# Altium schematic sheet OSPLC2_2_IO3.SchDoc
size 294 x 198 mm
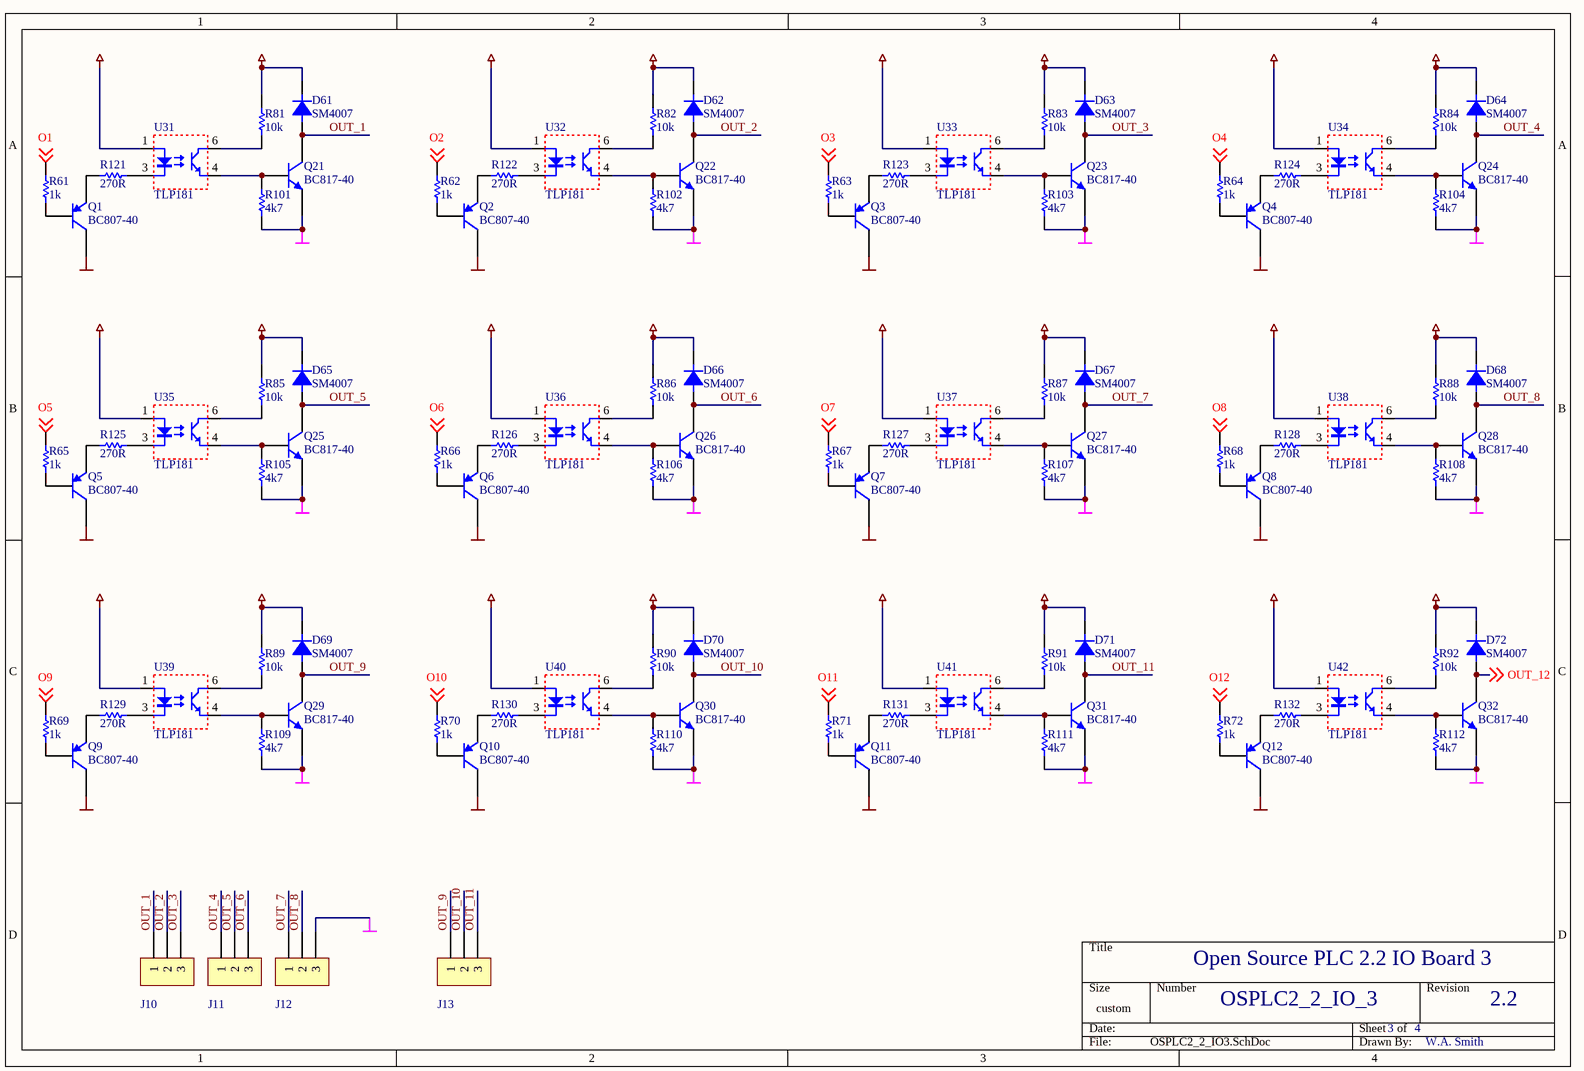
[diagram p0: OSPLC2_2_IO3.SchDoc]

## Parts
D61  SM4007  [MELF-2.2x2.5]
D62  SM4007  [MELF-2.2x2.5]
D63  SM4007  [MELF-2.2x2.5]
D64  SM4007  [MELF-2.2x2.5]
D65  SM4007  [MELF-2.2x2.5]
D66  SM4007  [MELF-2.2x2.5]
D67  SM4007  [MELF-2.2x2.5]
D68  SM4007  [MELF-2.2x2.5]
D69  SM4007  [MELF-2.2x2.5]
D70  SM4007  [MELF-2.2x2.5]
D71  SM4007  [MELF-2.2x2.5]
D72  SM4007  [MELF-2.2x2.5]
J10  PCB TERMINAL  [TERMINAL_3WAY_5MM]  (value not drawn)
J11  PCB TERMINAL  [TERMINAL_3WAY_5MM]  (value not drawn)
J12  PCB TERMINAL  [TERMINAL_3WAY_5MM]  (value not drawn)
J13  PCB TERMINAL  [TERMINAL_3WAY_5MM]  (value not drawn)
Q1  BC807-40  [SO-G3/Y1]
Q2  BC807-40  [SO-G3/Y1]
Q3  BC807-40  [SO-G3/Y1]
Q4  BC807-40  [SO-G3/Y1]
Q5  BC807-40  [SO-G3/Y1]
Q6  BC807-40  [SO-G3/Y1]
Q7  BC807-40  [SO-G3/Y1]
Q8  BC807-40  [SO-G3/Y1]
Q9  BC807-40  [SO-G3/Y1]
Q10  BC807-40  [SO-G3/Y1]
Q11  BC807-40  [SO-G3/Y1]
Q12  BC807-40  [SO-G3/Y1]
Q21  BC817-40  [SO-G3/Y1]
Q22  BC817-40  [SO-G3/Y1]
Q23  BC817-40  [SO-G3/Y1]
Q24  BC817-40  [SO-G3/Y1]
Q25  BC817-40  [SO-G3/Y1]
Q26  BC817-40  [SO-G3/Y1]
Q27  BC817-40  [SO-G3/Y1]
Q28  BC817-40  [SO-G3/Y1]
Q29  BC817-40  [SO-G3/Y1]
Q30  BC817-40  [SO-G3/Y1]
Q31  BC817-40  [SO-G3/Y1]
Q32  BC817-40  [SO-G3/Y1]
R61  value 1k  [0805]  (hidden comment: 0805)
R62  value 1k  [0805]  (hidden comment: 0805)
R63  value 1k  [0805]  (hidden comment: 0805)
R64  value 1k  [0805]  (hidden comment: 0805)
R65  value 1k  [0805]  (hidden comment: 0805)
R66  value 1k  [0805]  (hidden comment: 0805)
R67  value 1k  [0805]  (hidden comment: 0805)
R68  value 1k  [0805]  (hidden comment: 0805)
R69  value 1k  [0805]  (hidden comment: 0805)
R70  value 1k  [0805]  (hidden comment: 0805)
R71  value 1k  [0805]  (hidden comment: 0805)
R72  value 1k  [0805]  (hidden comment: 0805)
R81  value 10k  [0805]  (hidden comment: 0805)
R82  value 10k  [0805]  (hidden comment: 0805)
R83  value 10k  [0805]  (hidden comment: 0805)
R84  value 10k  [0805]  (hidden comment: 0805)
R85  value 10k  [0805]  (hidden comment: 0805)
R86  value 10k  [0805]  (hidden comment: 0805)
R87  value 10k  [0805]  (hidden comment: 0805)
R88  value 10k  [0805]  (hidden comment: 0805)
R89  value 10k  [0805]  (hidden comment: 0805)
R90  value 10k  [0805]  (hidden comment: 0805)
R91  value 10k  [0805]  (hidden comment: 0805)
R92  value 10k  [0805]  (hidden comment: 0805)
R101  value 4k7  [0805]  (hidden comment: 0805)
R102  value 4k7  [0805]  (hidden comment: 0805)
R103  value 4k7  [0805]  (hidden comment: 0805)
R104  value 4k7  [0805]  (hidden comment: 0805)
R105  value 4k7  [0805]  (hidden comment: 0805)
R106  value 4k7  [0805]  (hidden comment: 0805)
R107  value 4k7  [0805]  (hidden comment: 0805)
R108  value 4k7  [0805]  (hidden comment: 0805)
R109  value 4k7  [0805]  (hidden comment: 0805)
R110  value 4k7  [0805]  (hidden comment: 0805)
R111  value 4k7  [0805]  (hidden comment: 0805)
R112  value 4k7  [0805]  (hidden comment: 0805)
R121  value 270R  [0805]  (hidden comment: 0805)
R122  value 270R  [0805]  (hidden comment: 0805)
R123  value 270R  [0805]  (hidden comment: 0805)
R124  value 270R  [0805]  (hidden comment: 0805)
R125  value 270R  [0805]  (hidden comment: 0805)
R126  value 270R  [0805]  (hidden comment: 0805)
R127  value 270R  [0805]  (hidden comment: 0805)
R128  value 270R  [0805]  (hidden comment: 0805)
R129  value 270R  [0805]  (hidden comment: 0805)
R130  value 270R  [0805]  (hidden comment: 0805)
R131  value 270R  [0805]  (hidden comment: 0805)
R132  value 270R  [0805]  (hidden comment: 0805)
U31  TLP181  [SOP4_2.54]
U32  TLP181  [SOP4_2.54]
U33  TLP181  [SOP4_2.54]
U34  TLP181  [SOP4_2.54]
U35  TLP181  [SOP4_2.54]
U36  TLP181  [SOP4_2.54]
U37  TLP181  [SOP4_2.54]
U38  TLP181  [SOP4_2.54]
U39  TLP181  [SOP4_2.54]
U40  TLP181  [SOP4_2.54]
U41  TLP181  [SOP4_2.54]
U42  TLP181  [SOP4_2.54]

## Nets
GND: Q1.3(C) Q2.3(C) Q3.3(C) Q4.3(C) Q5.3(C) Q6.3(C) Q7.3(C) Q8.3(C) Q9.3(C) Q10.3(C) Q11.3(C) Q12.3(C)
OUT_GND: J12.3 Q21.2(E) Q22.2(E) Q23.2(E) Q24.2(E) Q25.2(E) Q26.2(E) Q27.2(E) Q28.2(E) Q29.2(E) Q30.2(E) Q31.2(E) Q32.2(E) R101.1 R102.1 R103.1 R104.1 R105.1 R106.1 R107.1 R108.1 R109.1 R110.1 R111.1 R112.1
VCC3v3: U31.1 U32.1 U33.1 U34.1 U35.1 U36.1 U37.1 U38.1 U39.1 U40.1 U41.1 U42.1
VCC24: D61.2(C) D62.2(C) D63.2(C) D64.2(C) D65.2(C) D66.2(C) D67.2(C) D68.2(C) D69.2(C) D70.2(C) D71.2(C) D72.2(C) R81.2 R82.2 R83.2 R84.2 R85.2 R86.2 R87.2 R88.2 R89.2 R90.2 R91.2 R92.2
O1: R61.2 ; off-sheet O1
O2: R62.2 ; off-sheet O2
O3: R63.2 ; off-sheet O3
O4: R64.2 ; off-sheet O4
O5: R65.2 ; off-sheet O5
O6: R66.2 ; off-sheet O6
O7: R67.2 ; off-sheet O7
O8: R68.2 ; off-sheet O8
O9: R69.2 ; off-sheet O9
O10: R70.2 ; off-sheet O10
O11: R71.2 ; off-sheet O11
O12: R72.2 ; off-sheet O12
OUT_1: D61.1(A) J10.1 Q21.3(C)
OUT_2: D62.1(A) J10.2 Q22.3(C)
OUT_3: D63.1(A) J10.3 Q23.3(C)
OUT_4: D64.1(A) J11.1 Q24.3(C)
OUT_5: D65.1(A) J11.2 Q25.3(C)
OUT_6: D66.1(A) J11.3 Q26.3(C)
OUT_7: D67.1(A) J12.1 Q27.3(C)
OUT_8: D68.1(A) J12.2 Q28.3(C)
OUT_9: D69.1(A) J13.1 Q29.3(C)
OUT_10: D70.1(A) J13.2 Q30.3(C)
OUT_11: D71.1(A) J13.3 Q31.3(C)
OUT_12: D72.1(A) Q32.3(C) ; off-sheet OUT_12
NetQ1_1: Q1.1(B) R61.1
NetQ1_2: Q1.2(E) R121.1
NetQ2_1: Q2.1(B) R62.1
NetQ2_2: Q2.2(E) R122.1
NetQ3_1: Q3.1(B) R63.1
NetQ3_2: Q3.2(E) R123.1
NetQ4_1: Q4.1(B) R64.1
NetQ4_2: Q4.2(E) R124.1
NetQ5_1: Q5.1(B) R65.1
NetQ5_2: Q5.2(E) R125.1
NetQ6_1: Q6.1(B) R66.1
NetQ6_2: Q6.2(E) R126.1
NetQ7_1: Q7.1(B) R67.1
NetQ7_2: Q7.2(E) R127.1
NetQ8_1: Q8.1(B) R68.1
NetQ8_2: Q8.2(E) R128.1
NetQ9_1: Q9.1(B) R69.1
NetQ9_2: Q9.2(E) R129.1
NetQ10_1: Q10.1(B) R70.1
NetQ10_2: Q10.2(E) R130.1
NetQ11_1: Q11.1(B) R71.1
NetQ11_2: Q11.2(E) R131.1
NetQ12_1: Q12.1(B) R72.1
NetQ12_2: Q12.2(E) R132.1
NetQ21_1: Q21.1(B) R101.2 U31.4
NetQ22_1: Q22.1(B) R102.2 U32.4
NetQ23_1: Q23.1(B) R103.2 U33.4
NetQ24_1: Q24.1(B) R104.2 U34.4
NetQ25_1: Q25.1(B) R105.2 U35.4
NetQ26_1: Q26.1(B) R106.2 U36.4
NetQ27_1: Q27.1(B) R107.2 U37.4
NetQ28_1: Q28.1(B) R108.2 U38.4
NetQ29_1: Q29.1(B) R109.2 U39.4
NetQ30_1: Q30.1(B) R110.2 U40.4
NetQ31_1: Q31.1(B) R111.2 U41.4
NetQ32_1: Q32.1(B) R112.2 U42.4
NetR81_1: R81.1 U31.6
NetR82_1: R82.1 U32.6
NetR83_1: R83.1 U33.6
NetR84_1: R84.1 U34.6
NetR85_1: R85.1 U35.6
NetR86_1: R86.1 U36.6
NetR87_1: R87.1 U37.6
NetR88_1: R88.1 U38.6
NetR89_1: R89.1 U39.6
NetR90_1: R90.1 U40.6
NetR91_1: R91.1 U41.6
NetR92_1: R92.1 U42.6
NetR121_2: R121.2 U31.3
NetR122_2: R122.2 U32.3
NetR123_2: R123.2 U33.3
NetR124_2: R124.2 U34.3
NetR125_2: R125.2 U35.3
NetR126_2: R126.2 U36.3
NetR127_2: R127.2 U37.3
NetR128_2: R128.2 U38.3
NetR129_2: R129.2 U39.3
NetR130_2: R130.2 U40.3
NetR131_2: R131.2 U41.3
NetR132_2: R132.2 U42.3

## Notes on the sheet
- Open Source PLC 2.2 IO Board 3
- OSPLC2_2_IO_3
- 2.2
- 3
- 4
- W.A. Smith

## Library data of the parts
D61-D72 = SM4007: 1A, 1000V MELF Rectifier; Value: SM4007
J10-J13 = TERMINAL_3WAY_5MM: 5mm spaced PCB terminal, 3 pole
Q1-Q12 = BC807-40: PNP General Purpose Amplifier; Manufacturer: Fairchild Semiconductor; Revision 1: 11-July-2000: SIM Model Added.; Revision 2: July-2002: Re-released for DXP Platform.; Package Information: Latest Revision: Sep-1998; Class I: Discrete; Class II: BJT - Low Power; Published: 8-Jun-2000; Datasheet: Latest Revision: 1997; Package Reference: SOT-23A; Publisher: Altium Limited
Q21-Q32 = BC817-40: NPN General Purpose Amplifier; Manufacturer: Fairchild Semiconductor; Revision 1: 11-July-2000: SIM Model Added.; Revision 2: July-2002: Re-released for DXP Platform.; Package Information: Latest Revision: Sep-1998; Class I: Discrete; Class II: BJT - Low Power; Published: 8-Jun-2000; Datasheet: Latest Revision: 1997; Package Reference: SOT-23A; Publisher: Altium Limited
R61-R72 R81-R92 R101-R112 R121-R132 = RES_0805: 0805 footprint resistor
U31-U42 = TLP181: Toshiba Photocoupler